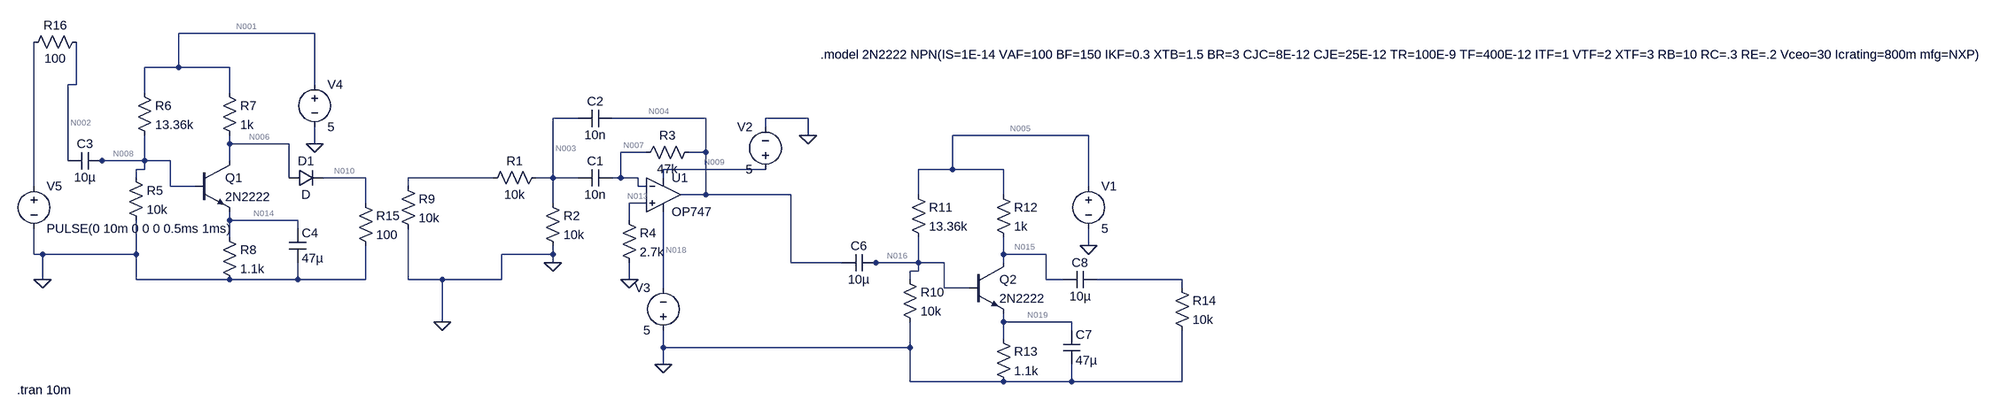
[diagram p0: schematic FILTER DESIGN EXP.asc]
FILTER DESIGN EXP.asc, the LTspice schematic file:
Version 4
SHEET 1 3068 680
WIRE -224 -144 -480 -144
WIRE -480 -80 -480 -144
WIRE -480 -80 -544 -80
WIRE -384 -80 -480 -80
WIRE -672 -48 -672 -128
WIRE -672 -48 -688 -48
WIRE -224 -48 -224 -144
WIRE -544 -32 -544 -80
WIRE -384 -32 -384 -80
WIRE 272 16 224 16
WIRE 512 16 336 16
WIRE 704 16 624 16
WIRE 624 32 624 16
WIRE 704 48 704 16
WIRE 1232 48 976 48
WIRE -384 64 -384 48
WIRE -272 64 -384 64
WIRE -224 64 -224 32
WIRE 400 80 352 80
WIRE 512 80 512 16
WIRE 512 80 480 80
WIRE -688 96 -688 -48
WIRE -624 96 -640 96
WIRE -544 96 -544 48
WIRE -544 96 -624 96
WIRE -496 96 -544 96
WIRE -384 96 -384 64
WIRE -544 112 -544 96
WIRE -544 112 -560 112
WIRE 624 112 432 112
WIRE 976 112 976 48
WIRE 976 112 912 112
WIRE 1072 112 976 112
WIRE -560 128 -560 112
WIRE -272 128 -272 64
WIRE -128 128 -208 128
WIRE 112 128 -48 128
WIRE 224 128 224 16
WIRE 224 128 192 128
WIRE 272 128 224 128
WIRE 352 128 352 80
WIRE 352 128 336 128
WIRE 384 128 352 128
WIRE 432 128 432 112
WIRE -752 144 -752 -128
WIRE -496 144 -496 96
WIRE -448 144 -496 144
WIRE -48 144 -48 128
WIRE 384 144 384 128
WIRE 400 144 384 144
WIRE 1232 144 1232 48
WIRE 512 160 512 80
WIRE 512 160 464 160
WIRE 672 160 512 160
WIRE 912 160 912 112
WIRE 1072 160 1072 112
WIRE -128 176 -128 128
WIRE 224 176 224 128
WIRE 400 176 368 176
WIRE -384 208 -384 192
WIRE -256 208 -384 208
WIRE 368 208 368 176
WIRE -256 224 -256 208
WIRE -384 240 -384 208
WIRE 1232 256 1232 224
WIRE -752 272 -752 224
WIRE -736 272 -752 272
WIRE -560 272 -560 208
WIRE -560 272 -736 272
WIRE 224 272 224 256
WIRE 224 272 128 272
WIRE 1072 272 1072 240
WIRE 1152 272 1072 272
WIRE 224 288 224 272
WIRE 672 288 672 160
WIRE 768 288 672 288
WIRE 832 288 816 288
WIRE 912 288 912 240
WIRE 912 288 832 288
WIRE 960 288 912 288
WIRE 1072 288 1072 272
WIRE 912 304 912 288
WIRE 912 304 896 304
WIRE -736 320 -736 272
WIRE -560 320 -560 272
WIRE -384 320 -560 320
WIRE -256 320 -256 288
WIRE -256 320 -384 320
WIRE -128 320 -128 256
WIRE -128 320 -256 320
WIRE -48 320 -48 224
WIRE 16 320 -48 320
WIRE 128 320 128 272
WIRE 128 320 16 320
WIRE 368 320 368 288
WIRE 896 320 896 304
WIRE 1152 320 1152 272
WIRE 1184 320 1152 320
WIRE 1408 320 1248 320
WIRE 432 336 432 192
WIRE 960 336 960 288
WIRE 1008 336 960 336
WIRE 1408 336 1408 320
WIRE 16 400 16 320
WIRE 1072 400 1072 384
WIRE 1200 400 1072 400
WIRE 1200 416 1200 400
WIRE 1072 432 1072 400
WIRE 432 448 432 416
WIRE 896 448 896 400
WIRE 896 448 432 448
WIRE 432 480 432 448
WIRE 896 512 896 448
WIRE 1072 512 896 512
WIRE 1200 512 1200 480
WIRE 1200 512 1072 512
WIRE 1408 512 1408 416
WIRE 1408 512 1200 512
FLAG 224 288 0
FLAG 368 320 0
FLAG 704 48 0
FLAG 432 480 0
FLAG -224 64 0
FLAG -736 320 0
FLAG 1232 256 0
FLAG 16 400 0
SYMBOL res 208 112 R90
WINDOW 0 0 56 VBottom 2
WINDOW 3 32 56 VTop 2
SYMATTR InstName R1
SYMATTR Value 10k
SYMBOL res 208 160 R0
SYMATTR InstName R2
SYMATTR Value 10k
SYMBOL cap 336 112 R90
WINDOW 0 0 32 VBottom 2
WINDOW 3 32 32 VTop 2
SYMATTR InstName C1
SYMATTR Value 10n
SYMBOL cap 336 0 R90
WINDOW 0 0 32 VBottom 2
WINDOW 3 32 32 VTop 2
SYMATTR InstName C2
SYMATTR Value 10n
SYMBOL res 496 64 R90
WINDOW 0 0 56 VBottom 2
WINDOW 3 32 56 VTop 2
SYMATTR InstName R3
SYMATTR Value 47k
SYMBOL OpAmps\\OP747 432 96 R0
SYMATTR InstName U1
SYMBOL res 352 192 R0
SYMATTR InstName R4
SYMATTR Value 2.7k
SYMBOL voltage 624 128 R180
WINDOW 0 24 96 Left 2
WINDOW 3 24 16 Left 2
WINDOW 123 0 0 Left 0
WINDOW 39 0 0 Left 0
SYMATTR InstName V2
SYMATTR Value 5
SYMBOL voltage 432 432 R180
WINDOW 0 24 96 Left 2
WINDOW 3 24 16 Left 2
WINDOW 123 0 0 Left 0
WINDOW 39 0 0 Left 0
SYMATTR InstName V3
SYMATTR Value 5
SYMBOL cap -624 80 R90
WINDOW 0 0 32 VBottom 2
WINDOW 3 32 32 VTop 2
SYMATTR InstName C3
SYMATTR Value 10µ
SYMBOL res -576 112 R0
SYMATTR InstName R5
SYMATTR Value 10k
SYMBOL res -560 -48 R0
SYMATTR InstName R6
SYMATTR Value 13.36k
SYMBOL res -400 -48 R0
SYMATTR InstName R7
SYMATTR Value 1k
SYMBOL res -400 224 R0
SYMATTR InstName R8
SYMATTR Value 1.1k
SYMBOL npn -448 96 R0
SYMATTR InstName Q1
SYMATTR Value 2N2222
SYMBOL voltage -224 -64 R0
WINDOW 123 0 0 Left 0
WINDOW 39 0 0 Left 0
SYMATTR InstName V4
SYMATTR Value 5
SYMBOL cap -272 224 R0
SYMATTR InstName C4
SYMATTR Value 47µ
SYMBOL res -64 128 R0
SYMATTR InstName R9
SYMATTR Value 10k
SYMBOL voltage -752 128 R0
WINDOW 123 0 0 Left 0
WINDOW 39 0 0 Left 0
SYMATTR InstName V5
SYMATTR Value PULSE(0 10m 0 0 0 0.5ms 1ms)
SYMBOL cap 832 272 R90
WINDOW 0 0 32 VBottom 2
WINDOW 3 32 32 VTop 2
SYMATTR InstName C6
SYMATTR Value 10µ
SYMBOL res 880 304 R0
SYMATTR InstName R10
SYMATTR Value 10k
SYMBOL res 896 144 R0
SYMATTR InstName R11
SYMATTR Value 13.36k
SYMBOL res 1056 144 R0
SYMATTR InstName R12
SYMATTR Value 1k
SYMBOL res 1056 416 R0
SYMATTR InstName R13
SYMATTR Value 1.1k
SYMBOL npn 1008 288 R0
SYMATTR InstName Q2
SYMATTR Value 2N2222
SYMBOL voltage 1232 128 R0
WINDOW 123 0 0 Left 0
WINDOW 39 0 0 Left 0
SYMATTR InstName V1
SYMATTR Value 5
SYMBOL cap 1184 416 R0
SYMATTR InstName C7
SYMATTR Value 47µ
SYMBOL cap 1248 304 R90
WINDOW 0 0 32 VBottom 2
WINDOW 3 32 32 VTop 2
SYMATTR InstName C8
SYMATTR Value 10µ
SYMBOL res 1392 320 R0
SYMATTR InstName R14
SYMATTR Value 10k
SYMBOL diode -272 144 R270
WINDOW 0 32 32 VTop 2
WINDOW 3 0 32 VBottom 2
SYMATTR InstName D1
SYMBOL res -656 -144 R90
WINDOW 0 0 56 VBottom 2
WINDOW 3 32 56 VTop 2
SYMATTR InstName R16
SYMATTR Value 100
SYMBOL res -144 160 R0
SYMATTR InstName R15
SYMATTR Value 100
TEXT -784 528 Left 2 !.tran 10m
TEXT 728 -104 Left 2 !.model 2N2222 NPN(IS=1E-14 VAF=100 BF=150 IKF=0.3 XTB=1.5 BR=3 CJC=8E-12 CJE=25E-12 TR=100E-9 TF=400E-12 ITF=1 VTF=2 XTF=3 RB=10 RC=.3 RE=.2 Vceo=30 Icrating=800m mfg=NXP)

The netlist it stands for:
* FILTER DESIGN EXP.asc
R1 N003 N011 10k
R2 N003 0 10k
C1 N007 N003 10n
C2 N004 N003 10n
R3 N004 N007 47k
XU1 N013 N007 N009 N018 N004 OP747  ; pins In+ In- V+ V- OUT
R4 N013 0 2.7k
V2 N009 0 5
V3 0 N018 5
C3 N008 N002 10µ
R5 N008 0 10k
R6 N001 N008 13.36k
R7 N001 N006 1k
R8 N014 0 1.1k
Q1 N006 N008 N014 0 2N2222
V4 N001 0 5
C4 N014 0 47µ
R9 N011 0 10k
V5 N012 0 PULSE(0 10m 0 0 0 0.5ms 1ms)
C6 N016 N004 10µ
R10 N016 0 10k
R11 N005 N016 13.36k
R12 N005 N015 1k
R13 N019 0 1.1k
Q2 N015 N016 N019 0 2N2222
V1 N005 0 5
C7 N019 0 47µ
C8 N017 N015 10µ
R14 N017 0 10k
D1 N006 N010 D
R16 N002 N012 100
R15 N010 0 100
.model D D
.lib standard.dio
.model NPN NPN
.model PNP PNP
.lib standard.bjt
.tran 10m
.model 2N2222 NPN(IS=1E-14 VAF=100 BF=150 IKF=0.3 XTB=1.5 BR=3 CJC=8E-12 CJE=25E-12 TR=100E-9 TF=400E-12 ITF=1 VTF=2 XTF=3 RB=10 RC=.3 RE=.2 Vceo=30 Icrating=800m mfg=NXP)
.backanno
.end

* Results of the author's LTspice run, read from the files saved beside the schematic
* Operating Point, zero values left out:
*   V(n007) = 111.3 µV
*   V(n004) = -339.8 µV
*   V(n018) = -5 V
*   V(n009) = 5 V
*   V(n013) = 31.32 µV
*   V(n008) = 1.626 V
*   V(n001) = 5 V
*   V(n006) = 1.006 V
*   V(n014) = 966.2 mV
*   V(n016) = 2.092 V
*   V(n005) = 5 V
*   V(n015) = 3.709 V
*   V(n019) = 1.43 V
*   V(n010) = 320.6 mV
*   Ic(Q1) = 788.3 µA
*   Ib(Q1) = 90.03 µA
*   Ie(Q1) = -878.4 µA
*   Ic(Q2) = 1.291 mA
*   Ib(Q2) = 8.509 µA
*   Ie(Q2) = -1.3 mA
*   I(D1) = 3.206 mA
*   I(R3) = -9.598 nA
*   I(R4) = 11.6 nA
*   I(R5) = 162.6 µA
*   I(R6) = 252.6 µA
*   I(R7) = 3.994 mA
*   I(R8) = 878.4 µA
*   I(R10) = 209.2 µA
*   I(R11) = 217.7 µA
*   I(R12) = 1.291 mA
*   I(R13) = 1.3 mA
*   I(R15) = 3.206 mA
*   I(V2) = -233.8 µA
*   I(V3) = -233.8 µA
*   I(V4) = -4.247 mA
*   I(V1) = -1.509 mA
*   Ix(u1:1) = -11.6 nA
*   Ix(u1:2) = -9.598 nA
*   Ix(u1:99) = 233.8 µA
*   Ix(u1:50) = -233.8 µA
*   Ix(u1:45) = 9.598 nA
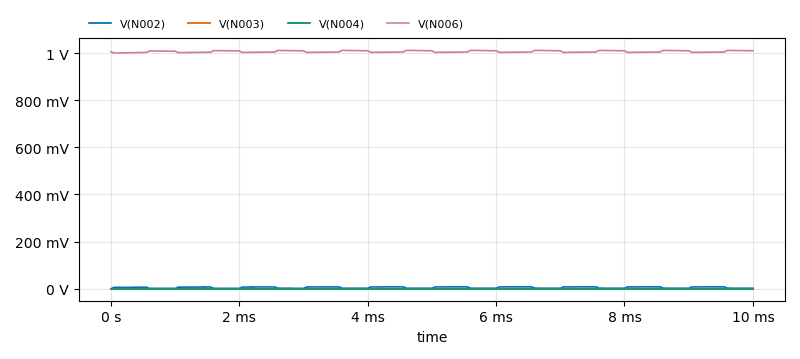
[diagram p1: Transient Analysis of FILTER DESIGN EXP.asc, plotted from the saved traces]
* Transient Analysis, 1 run:
*   V(N002): min -160.6 nV, max 8.31 mV, average 5.023 mV, rms 5.75 mV, last 1.918 mV
*   V(N003): min -220.7 nV, max 467.4 nV, average 0 V, rms 10.38 pV, last 360 fV
*   V(N004): min -340 µV, max -339.3 µV, average -339.8 µV, rms 339.8 µV, last -339.8 µV
*   V(N006): min 1 V, max 1.011 V, average 1.006 V, rms 1.006 V, last 1.01 V